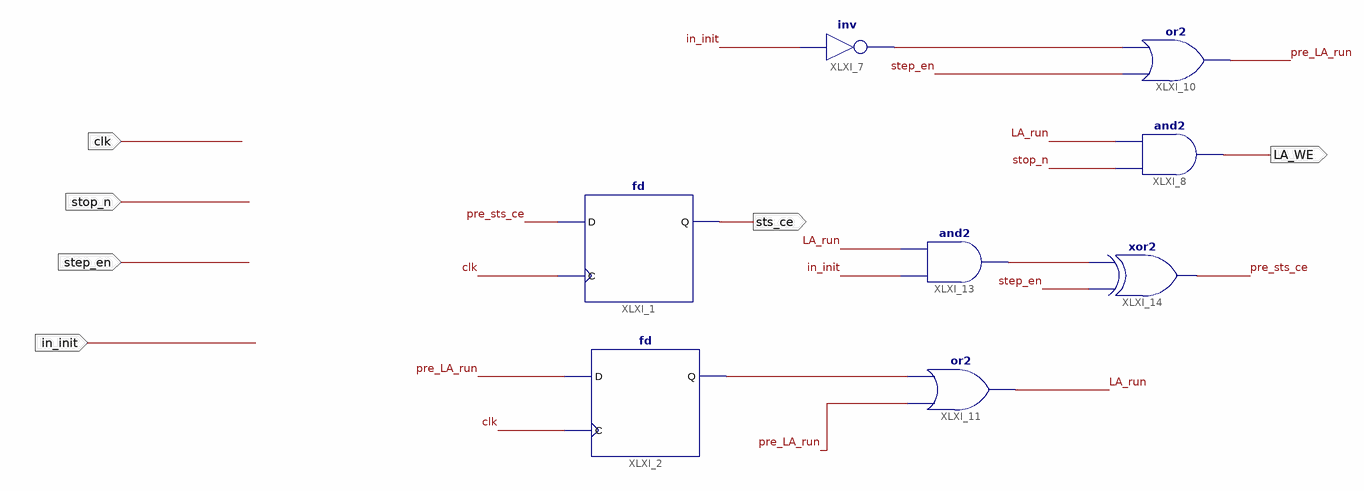
[diagram p0: schematic sheet 1]
// Xilinx ISE schematic LA_control.sch (spartan6) as structural Verilog: 8 symbols, 6 ports
module LA_control (
  input  clk,
  input  stop_n,
  input  step_en,
  input  in_init,
  output LA_WE,
  output sts_ce
);

  wire LA_run, pre_LA_run, pre_sts_ce, XLXN_4, XLXN_20, XLXN_22;

  fd XLXI_1 (.C(clk), .D(pre_sts_ce), .Q(sts_ce));
  fd XLXI_2 (.C(clk), .D(pre_LA_run), .Q(XLXN_4));
  not XLXI_7 (XLXN_20, in_init);
  and XLXI_8 (LA_WE, stop_n, LA_run);
  or XLXI_10 (pre_LA_run, step_en, XLXN_20);
  or XLXI_11 (LA_run, pre_LA_run, XLXN_4);
  and XLXI_13 (XLXN_22, in_init, LA_run);
  xor XLXI_14 (pre_sts_ce, step_en, XLXN_22);
endmodule
